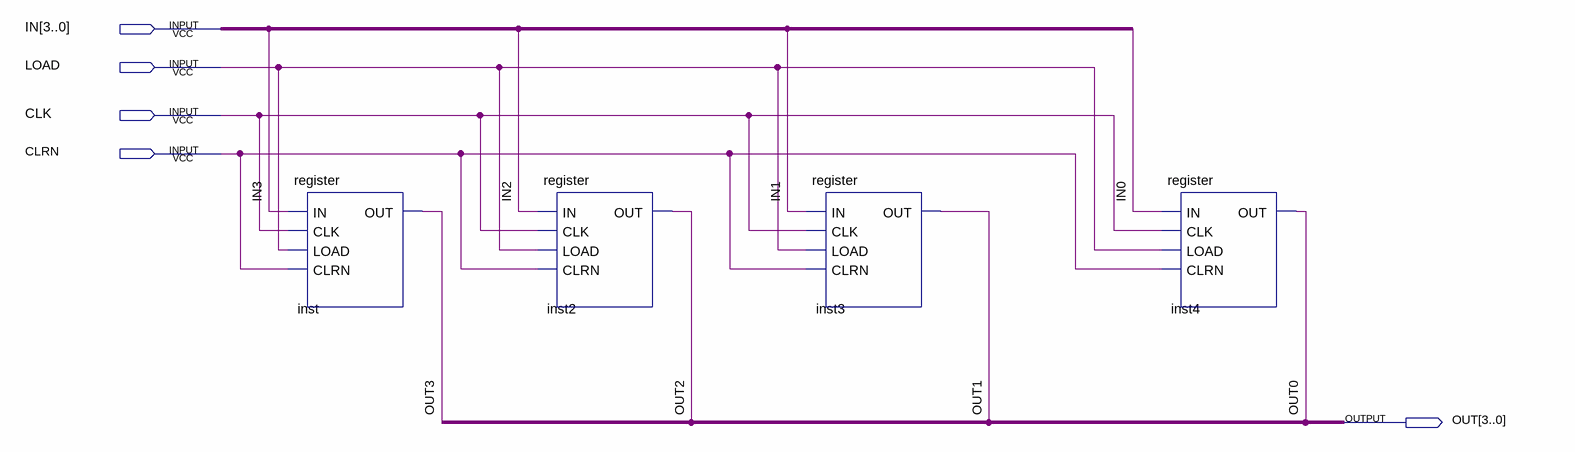
[diagram p0: schematic sheet]
// Quartus schematic reg4b.bdf as structural Verilog: 4 symbols, 5 pins
module reg4b (
  input  [3:0] IN,
  input  LOAD,
  input  CLK,
  input  CLRN,
  output [3:0] OUT
);

  register inst (.IN(IN[3]), .CLK(CLK), .LOAD(LOAD), .CLRN(CLRN), .OUT(OUT[3]));
  register inst2 (.IN(IN[2]), .CLK(CLK), .LOAD(LOAD), .CLRN(CLRN), .OUT(OUT[2]));
  register inst3 (.IN(IN[1]), .CLK(CLK), .LOAD(LOAD), .CLRN(CLRN), .OUT(OUT[1]));
  register inst4 (.IN(IN[0]), .CLK(CLK), .LOAD(LOAD), .CLRN(CLRN), .OUT(OUT[0]));
endmodule
